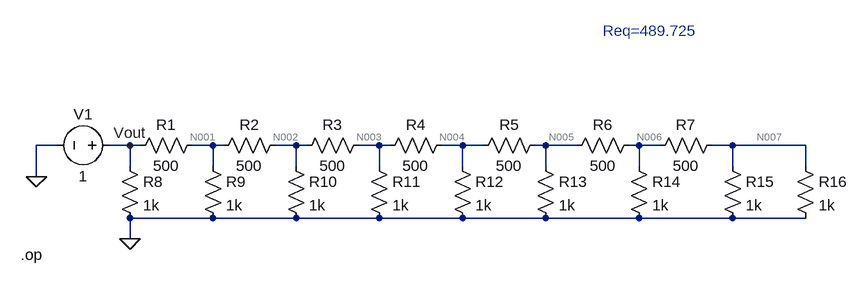
[diagram p0: schematic Lab2In.asc]
Lab2In.asc, the LTspice schematic file:
Version 4
SHEET 1 888 680
WIRE -368 0 -400 0
WIRE -256 0 -288 0
WIRE -240 0 -256 0
WIRE -128 0 -160 0
WIRE -112 0 -128 0
WIRE 0 0 -32 0
WIRE 16 0 0 0
WIRE 128 0 96 0
WIRE 144 0 128 0
WIRE 256 0 224 0
WIRE 288 0 256 0
WIRE 384 0 368 0
WIRE 432 0 384 0
WIRE 528 0 512 0
WIRE 560 0 528 0
WIRE 672 0 640 0
WIRE 784 0 672 0
WIRE -256 32 -256 0
WIRE -128 32 -128 0
WIRE 0 32 0 0
WIRE 128 32 128 0
WIRE 256 32 256 0
WIRE 384 32 384 0
WIRE 528 32 528 0
WIRE 672 32 672 0
WIRE 784 32 784 0
WIRE -400 48 -400 0
WIRE -128 112 -256 112
WIRE 0 112 -128 112
WIRE 128 112 0 112
WIRE 256 112 128 112
WIRE 384 112 256 112
WIRE 528 112 384 112
WIRE 672 112 528 112
WIRE 784 112 672 112
WIRE -256 144 -256 112
FLAG -256 144 0
FLAG -400 48 0
FLAG -256 0 Vout
SYMBOL voltage -272 0 R90
WINDOW 0 -32 56 VBottom 2
WINDOW 3 32 56 VTop 2
WINDOW 123 0 0 Left 0
WINDOW 39 0 0 Left 0
SYMATTR InstName V1
SYMATTR Value 1
SYMBOL res -144 -16 R90
WINDOW 0 0 56 VBottom 2
WINDOW 3 32 56 VTop 2
SYMATTR InstName R1
SYMATTR Value 500
SYMBOL res -16 -16 R90
WINDOW 0 0 56 VBottom 2
WINDOW 3 32 56 VTop 2
SYMATTR InstName R2
SYMATTR Value 500
SYMBOL res 112 -16 R90
WINDOW 0 0 56 VBottom 2
WINDOW 3 32 56 VTop 2
SYMATTR InstName R3
SYMATTR Value 500
SYMBOL res 240 -16 R90
WINDOW 0 0 56 VBottom 2
WINDOW 3 32 56 VTop 2
SYMATTR InstName R4
SYMATTR Value 500
SYMBOL res 384 -16 R90
WINDOW 0 0 56 VBottom 2
WINDOW 3 32 56 VTop 2
SYMATTR InstName R5
SYMATTR Value 500
SYMBOL res 528 -16 R90
WINDOW 0 0 56 VBottom 2
WINDOW 3 32 56 VTop 2
SYMATTR InstName R6
SYMATTR Value 500
SYMBOL res 656 -16 R90
WINDOW 0 0 56 VBottom 2
WINDOW 3 32 56 VTop 2
SYMATTR InstName R7
SYMATTR Value 500
SYMBOL res -272 16 R0
SYMATTR InstName R8
SYMATTR Value 1k
SYMBOL res -144 16 R0
SYMATTR InstName R9
SYMATTR Value 1k
SYMBOL res -16 16 R0
SYMATTR InstName R10
SYMATTR Value 1k
SYMBOL res 112 16 R0
SYMATTR InstName R11
SYMATTR Value 1k
SYMBOL res 240 16 R0
SYMATTR InstName R12
SYMATTR Value 1k
SYMBOL res 368 16 R0
SYMATTR InstName R13
SYMATTR Value 1k
SYMBOL res 512 16 R0
SYMATTR InstName R14
SYMATTR Value 1k
SYMBOL res 656 16 R0
SYMATTR InstName R15
SYMATTR Value 1k
SYMBOL res 768 16 R0
SYMATTR InstName R16
SYMATTR Value 1k
TEXT -424 168 Left 2 !.op
TEXT 472 -176 Left 2 ;Req=489.725

The netlist it stands for:
* Lab2In.asc
V1 Vout 0 1
R1 N001 Vout 500
R2 N002 N001 500
R3 N003 N002 500
R4 N004 N003 500
R5 N005 N004 500
R6 N006 N005 500
R7 N007 N006 500
R8 Vout 0 1k
R9 N001 0 1k
R10 N002 0 1k
R11 N003 0 1k
R12 N004 0 1k
R13 N005 0 1k
R14 N006 0 1k
R15 N007 0 1k
R16 N007 0 1k
.op
* Req=489.725
.backanno
.end

* Results of the author's LTspice run, read from the files saved beside the schematic
* Operating Point:
*   V(vout) = 1 V
*   V(n001) = 500 mV
*   V(n002) = 250 mV
*   V(n003) = 125 mV
*   V(n004) = 62.5 mV
*   V(n005) = 31.25 mV
*   V(n006) = 15.62 mV
*   V(n007) = 7.812 mV
*   I(R16) = 7.813 µA
*   I(R15) = 7.813 µA
*   I(R14) = 15.63 µA
*   I(R13) = 31.25 µA
*   I(R12) = 62.5 µA
*   I(R11) = 125 µA
*   I(R10) = 250 µA
*   I(R9) = 500 µA
*   I(R8) = 1 mA
*   I(R7) = -15.63 µA
*   I(R6) = -31.25 µA
*   I(R5) = -62.5 µA
*   I(R4) = -125 µA
*   I(R3) = -250 µA
*   I(R2) = -500 µA
*   I(R1) = -1 mA
*   I(V1) = -2 mA